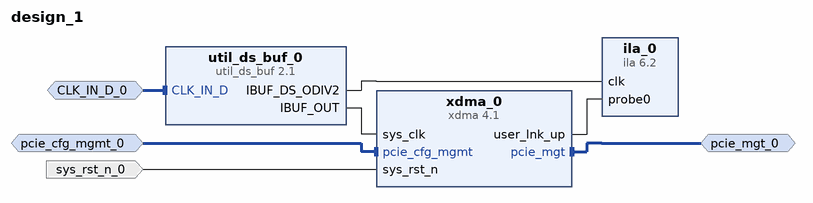
[diagram p0: block diagram of the top level]
# Vivado block design design_1, xc7vx690tffg1761-2, Vivado 2018.3
create_bd_design design_1

create_bd_intf_port -mode Slave -vlnv xilinx.com:interface:diff_clock_rtl:1.0 CLK_IN_D_0
create_bd_intf_port -mode Slave -vlnv xilinx.com:interface:pcie_cfg_mgmt_rtl:1.0 pcie_cfg_mgmt_0
create_bd_intf_port -mode Master -vlnv xilinx.com:interface:pcie_7x_mgt_rtl:1.0 pcie_mgt_0
create_bd_port -dir I -type rst sys_rst_n_0

create_bd_cell -type ip -vlnv xilinx.com:ip:xdma:4.1 xdma_0
create_bd_cell -type ip -vlnv xilinx.com:ip:util_ds_buf:2.1 util_ds_buf_0
set_property -dict {CONFIG.C_BUF_TYPE IBUFDSGTE} [get_bd_cells util_ds_buf_0]
create_bd_cell -type ip -vlnv xilinx.com:ip:ila:6.2 ila_0
set_property -dict {CONFIG.C_ENABLE_ILA_AXI_MON false CONFIG.C_MONITOR_TYPE Native CONFIG.C_NUM_OF_PROBES 1} [get_bd_cells ila_0]

# ---- connections ----

connect_bd_intf_net -intf_net CLK_IN_D_0_1 [get_bd_intf_ports CLK_IN_D_0] [get_bd_intf_pins util_ds_buf_0/CLK_IN_D]
connect_bd_intf_net -intf_net pcie_cfg_mgmt_0_1 [get_bd_intf_ports pcie_cfg_mgmt_0] [get_bd_intf_pins xdma_0/pcie_cfg_mgmt]
connect_bd_intf_net [get_bd_intf_ports pcie_mgt_0] [get_bd_intf_pins xdma_0/pcie_mgt]
connect_bd_net [get_bd_pins util_ds_buf_0/IBUF_OUT] [get_bd_pins xdma_0/sys_clk]
connect_bd_net -net sys_rst_n_0_1 [get_bd_ports sys_rst_n_0] [get_bd_pins xdma_0/sys_rst_n]
connect_bd_net [get_bd_pins util_ds_buf_0/IBUF_DS_ODIV2] [get_bd_pins ila_0/clk]
connect_bd_net [get_bd_pins xdma_0/user_lnk_up] [get_bd_pins ila_0/probe0]

validate_bd_design
save_bd_design
